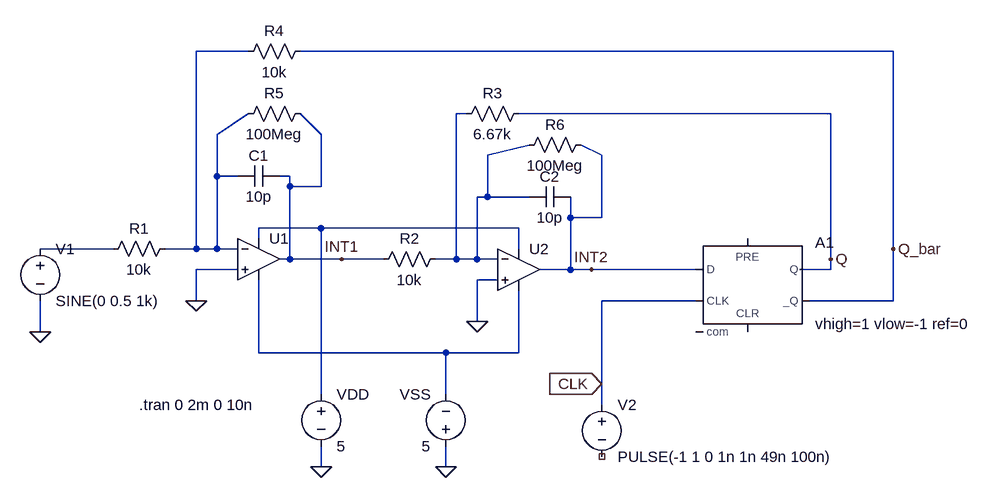
[diagram p0: schematic sigma_delta_circuit.asc]
sigma_delta_circuit.asc, the LTspice schematic file:
Version 4.1
SHEET 1 1248 680
WIRE 96 -192 16 -192
WIRE 1088 -192 176 -192
WIRE 432 -96 416 -96
WIRE 992 -96 512 -96
WIRE 48 -64 96 -96
WIRE 208 -64 176 -96
WIRE 464 -32 528 -48
WIRE 640 -32 608 -48
WIRE 48 0 48 -64
WIRE 80 0 48 0
WIRE 160 0 144 0
WIRE 160 16 160 0
WIRE 208 16 208 -64
WIRE 208 16 160 16
WIRE 464 32 464 -32
WIRE 464 32 448 32
WIRE 528 32 464 32
WIRE 592 64 592 32
WIRE 640 64 640 -32
WIRE 640 64 592 64
WIRE 208 80 112 80
WIRE 512 80 208 80
WIRE 112 96 112 80
WIRE -112 112 -224 112
WIRE 16 112 16 -192
WIRE 16 112 -32 112
WIRE 48 112 48 0
WIRE 48 112 16 112
WIRE 80 112 48 112
WIRE 512 112 512 80
WIRE 1088 112 1088 -192
WIRE 160 128 160 16
WIRE 160 128 144 128
WIRE 240 128 160 128
WIRE 304 128 240 128
WIRE 416 128 416 -96
WIRE 416 128 384 128
WIRE 448 128 448 32
WIRE 448 128 416 128
WIRE 480 128 448 128
WIRE 992 128 992 -96
WIRE 80 144 16 144
WIRE 592 144 592 64
WIRE 592 144 544 144
WIRE 624 144 592 144
WIRE 784 144 624 144
WIRE 992 144 992 128
WIRE 992 144 944 144
WIRE 480 160 448 160
WIRE 16 192 16 144
WIRE 784 192 640 192
WIRE 1088 192 1088 112
WIRE 1088 192 960 192
WIRE 448 224 448 160
WIRE -224 240 -224 192
WIRE 112 272 112 160
WIRE 400 272 112 272
WIRE 512 272 512 176
WIRE 512 272 400 272
WIRE 640 320 640 192
WIRE 208 336 208 80
WIRE 400 336 400 272
WIRE 640 352 640 320
WIRE 208 448 208 416
WIRE 400 448 400 416
FLAG 16 192 0
FLAG 448 224 0
FLAG -224 240 0
FLAG 640 320 CLK
IOPIN 640 320 In
FLAG 208 448 0
FLAG 400 448 0
FLAG 240 128 INT1
FLAG 624 144 INT2
FLAG 992 128 Q
FLAG 1088 112 Q_bar
SYMBOL cap 144 -16 R90
WINDOW 0 0 32 VBottom 2
WINDOW 3 32 32 VTop 2
SYMATTR InstName C1
SYMATTR Value 10p
SYMBOL cap 592 16 R90
WINDOW 0 0 32 VBottom 2
WINDOW 3 32 32 VTop 2
SYMATTR InstName C2
SYMATTR Value 10p
SYMBOL res -16 96 R90
WINDOW 0 0 56 VBottom 2
WINDOW 3 32 56 VTop 2
SYMATTR InstName R1
SYMATTR Value 10k
SYMBOL res 400 112 R90
WINDOW 0 0 56 VBottom 2
WINDOW 3 32 56 VTop 2
SYMATTR InstName R2
SYMATTR Value 10k
SYMBOL res 528 -112 R90
WINDOW 0 0 56 VBottom 2
WINDOW 3 32 56 VTop 2
SYMATTR InstName R3
SYMATTR Value 6.67k
SYMBOL res 192 -208 R90
WINDOW 0 0 56 VBottom 2
WINDOW 3 32 56 VTop 2
SYMATTR InstName R4
SYMATTR Value 10k
SYMBOL voltage -224 96 R0
WINDOW 123 0 0 Left 0
WINDOW 39 0 0 Left 0
SYMATTR InstName V1
SYMATTR Value SINE(0 0.5 1k)
SYMBOL voltage 640 336 R0
WINDOW 123 0 0 Left 0
WINDOW 39 0 0 Left 0
SYMATTR InstName V2
SYMATTR Value PULSE(-1 1 0 1n 1n 49n 100n)
SYMBOL Digital\\dflop 864 96 R0
WINDOW 3 104 132 Left 2
SYMATTR Value vhigh=1 vlow=-1 ref=0
SYMATTR InstName A1
SYMBOL OpAmps\\UniversalOpAmp2 112 128 R0
SYMATTR InstName U1
SYMATTR Value2 Avol=1Meg GBW=10G Slew=10G
SYMBOL OpAmps\\UniversalOpAmp2 512 144 R0
SYMATTR InstName U2
SYMBOL voltage 208 320 R0
WINDOW 123 0 0 Left 0
WINDOW 39 0 0 Left 0
SYMATTR InstName VDD
SYMATTR Value 5
SYMBOL voltage 400 432 R180
WINDOW 0 24 96 Left 2
WINDOW 3 24 16 Left 2
WINDOW 123 0 0 Left 0
WINDOW 39 0 0 Left 0
SYMATTR InstName VSS
SYMATTR Value 5
SYMBOL res 192 -112 R90
WINDOW 0 0 56 VBottom 2
WINDOW 3 32 56 VTop 2
SYMATTR InstName R5
SYMATTR Value 100Meg
SYMBOL res 624 -64 R90
WINDOW 0 0 56 VBottom 2
WINDOW 3 32 56 VTop 2
SYMATTR InstName R6
SYMATTR Value 100Meg
TEXT -72 352 Left 2 !.tran 0 2m 0 10n

The netlist it stands for:
* sigma_delta_circuit.asc
C1 INT1 N001 10p
C2 INT2 N002 10p
R1 N001 N004 10k
R2 N002 INT1 10k
R3 Q N002 6.67k
R4 Q_bar N001 10k
V1 N004 0 SINE(0 0.5 1k)
V2 CLK NC_01 PULSE(-1 1 0 1n 1n 49n 100n)
A1 INT2 0 CLK 0 0 Q_bar Q 0 DFLOP vhigh=1 vlow=-1 ref=0
X§U1 0 N001 N003 N005 INT1 level2 Avol=1Meg GBW=10G Slew=10G Ilimit=25m Rail=0 Vos=0 En=0 Enk=0 In=0 Ink=0 Rin=500Meg  ; pins In+ In- V+ V- OUT
X§U2 0 N002 N003 N005 INT2 level2 Avol=1Meg GBW=10Meg Slew=10Meg Ilimit=25m Rail=0 Vos=0 En=0 Enk=0 In=0 Ink=0 Rin=500Meg  ; pins In+ In- V+ V- OUT
VDD N003 0 5
VSS 0 N005 5
R5 INT1 N001 100Meg
R6 INT2 N002 100Meg
.tran 0 2m 0 10n
.lib UniversalOpAmp2.lib
.backanno
.end